# EAGLE design usb_switch (EAGLE 9.2.2)
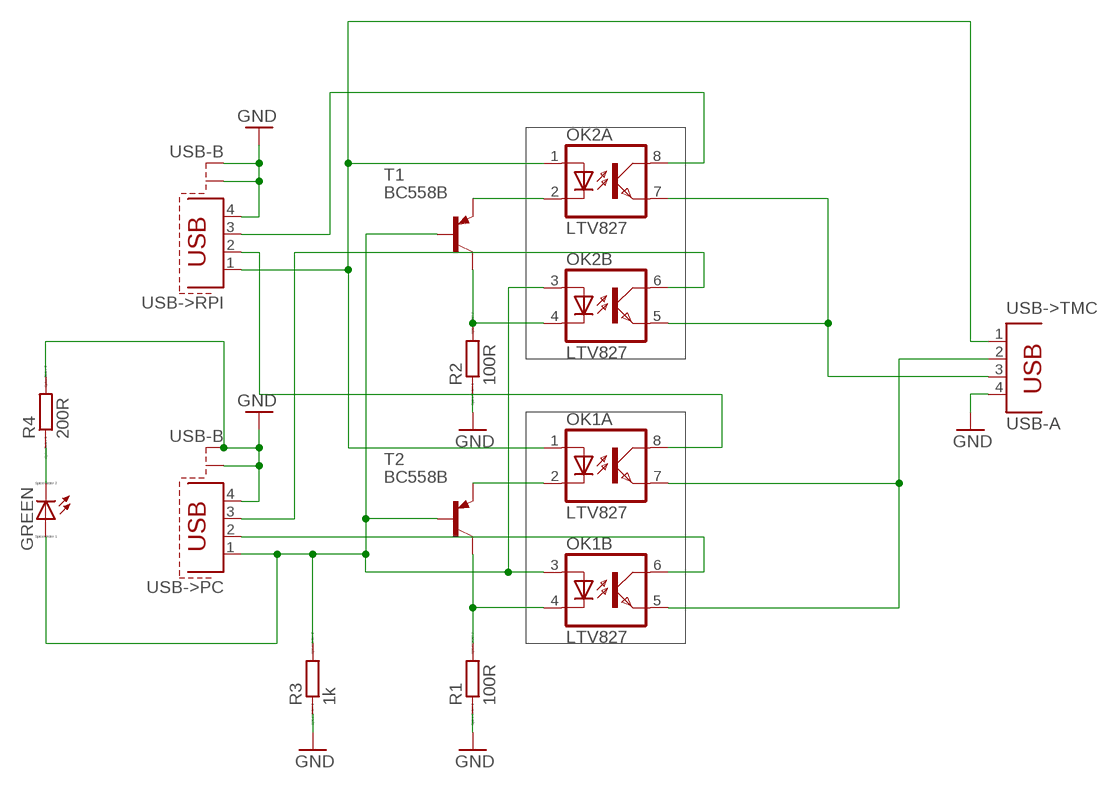
[diagram p0: schematic, sheet 1]

## Parts
GREEN  LED_ELD260  [LED_LD260]
OK1  LTV827  LTV826  [DIL08]
OK2  LTV827  LTV826  [DIL08]
R1  100R  R0204/7  [0204/7]
R2  100R  R0204/7  [0204/7]
R3  1k  R0204/7  [0204/7]
R4  200R  R0204/7  [0204/7]
T1  BC558B  -PNP-TO92-BEC  [TO92-BEC]
T2  BC558B  -PNP-TO92-BEC  [TO92-BEC]
USB->PC  USB-B  PN61729-S  [PN61729-S]
USB->RPI  USB-B  PN61729-S  [PN61729-S]
USB->TMC  USB-A  PN87520  [PN87520]

## Nets
GND: R1.1 R2.1 R3.1 R4.2 USB->PC.4 USB->PC.S1 USB->PC.S2 USB->RPI.4 USB->RPI.S1 USB->RPI.S2 USB->TMC.4
N$1: OK2.5(B:EMIT) OK2.7(A:EMIT) USB->TMC.3
N$2: OK1.5(B:EMIT) OK1.7(A:EMIT) USB->TMC.2
N$3: OK2.4(B:C) R2.2 T1.C
N$4: OK1.4(B:C) R1.2 T2.C
N$5: OK1.2(A:C) T2.E
N$6: OK2.2(A:C) T1.E
N$7: GREEN.A OK1.3(B:A) OK2.3(B:A) R3.2 T1.B T2.B USB->PC.1
N$8: OK1.1(A:A) OK2.1(A:A) USB->RPI.1 USB->TMC.1
N$9: OK2.8(A:COL) USB->RPI.3
N$10: OK2.6(B:COL) USB->PC.3
N$11: OK1.6(B:COL) USB->PC.2
N$12: OK1.8(A:COL) USB->RPI.2
N$15: GREEN.K(C) R4.1

## Library data of the parts
GREEN = eagle-ltspice:LED_E: LED Source: http://www.osram.convergy.de Source: www.luxeon.com Source: www.kingbright.com; SPICEMODEL: NONE; SPICEPREFIX: D; SPICETYPE: diode
OK1 OK2 = optocoupler:LTV826: OPTO COUPLER Source: LITEON, LTV816.pdf; OC_FARNELL: unknown; OC_NEWARK: unknown
R1-R4 = eagle-ltspice:R: RESISTOR, European symbol; SPICEMODEL: NONE; SPICEPREFIX: R
T1 T2 = transistor:*-PNP-: PNP Transistror
USB->PC USB->RPI = con-berg:PN61729-S: BERG USB connector; OC_FARNELL: unknown; OC_NEWARK: unknown
USB->TMC = con-berg:PN87520: BERG USB connector; OC_FARNELL: unknown; OC_NEWARK: unknown

## Board
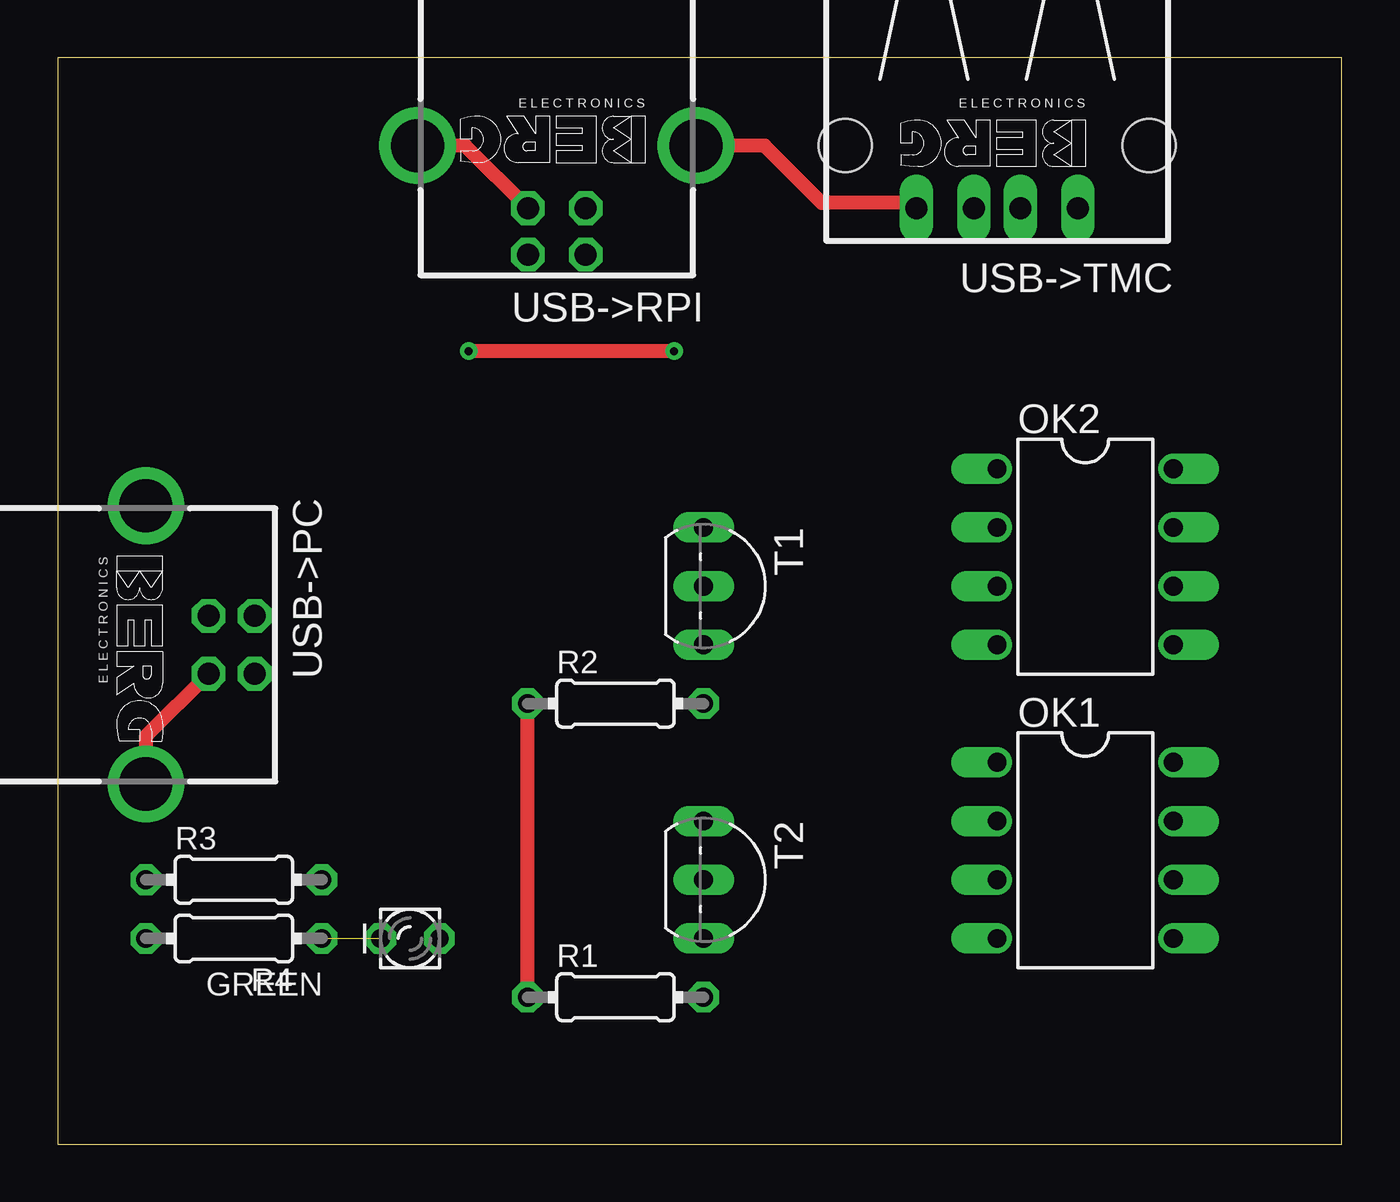
[diagram p1: board, top side]
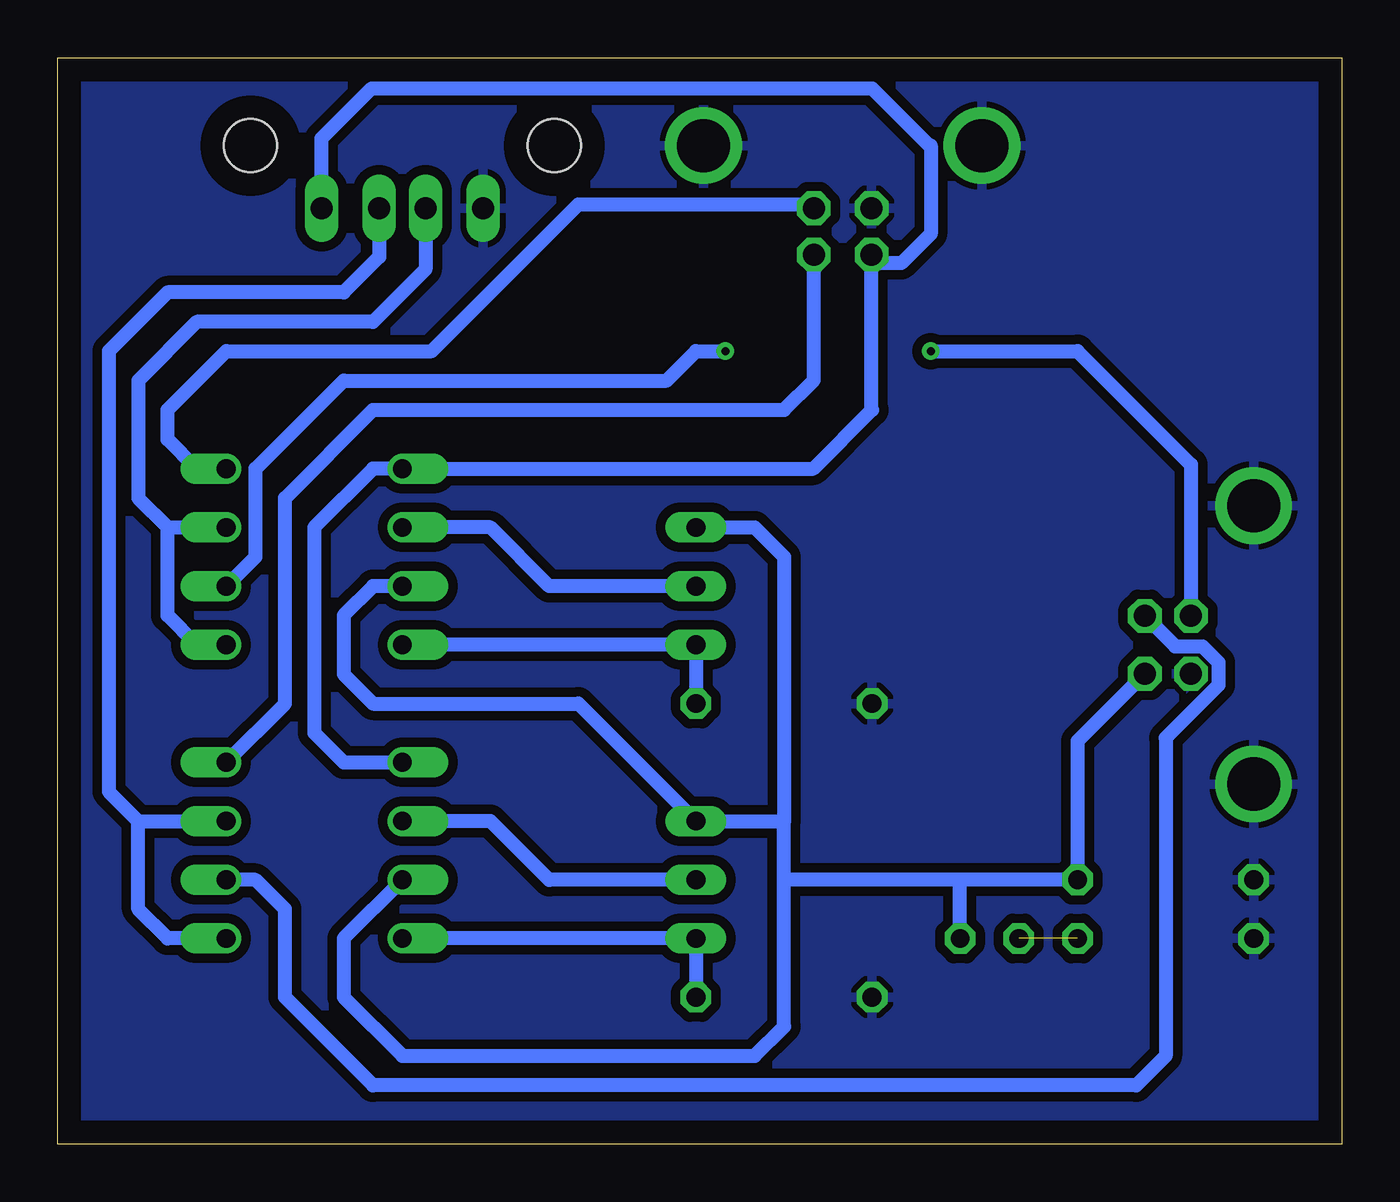
[diagram p2: board, bottom side, seen from below]

Size 55.55 x 46.98 mm. Coordinates in mm from the lower left corner, seen from the top.
Outline: 0,0 55.55,0 55.55,46.98 0,46.98 0,0
Copper layers (1*16): Top 0.035mm / dielectric 1.5mm / Bottom 0.035mm
Design rules "default": minimum track width 6mil, minimum drill 0.35mm, track to track 6mil, track to pad 6mil, pad to pad 6mil, via to via 6mil, smd to smd 6mil, copper to edge 40mil, drill to drill 6mil, minimum pad ring 10mil, minimum via ring 8mil, stop-mask expansion 4mil, vias tented up to drill 0mil, thermal gap 10mil

### Footprints (pad centres in the part's own frame; a part is rotated, then mirrored left to right if it is on the bottom)
LED_LD260 = drill 0.813 octagon: A -1.27,0; K 1.27,0
DIL08 = drill 0.813 offset: 1 -3.81,-3.81; 2 -1.27,-3.81; 3 1.27,-3.81; 4 3.81,-3.81; 5 3.81,3.81; 6 1.27,3.81; 7 -1.27,3.81; 8 -3.81,3.81
0204/7 = drill 0.813 octagon: 1 -3.81,0; 2 3.81,0
TO92-BEC = drill 0.813 long: B -2.54,0; C 2.54,0; E 0,0
PN61729-S = drill 0.95 octagon: 1 1.25,4.71; 2 -1.25,4.71; 3 -1.25,2.71; 4 1.25,2.71 | drill 2.3 pad 2.9: S1 -6.02,0; S2 6.02,0
PN87520 = drill 0.95 long: 1 -3.5,2.71; 2 -1,2.71; 3 1,2.71; 4 3.5,2.71 | hole 2.3: -6.57,0; 6.57,0

### Placement (x,y rotation side)
GREEN  15.24,8.89 180 top
OK1  44.45,12.7 270 top
OK2  44.45,25.4 270 top
R1  24.13,6.35 0 top
R2  24.13,19.05 0 top
R3  7.62,11.43 0 top
R4  7.62,8.89 180 top
T1  27.94,24.13 270 top
T2  27.94,11.43 270 top
USB->PC  3.81,21.59 270 top
USB->RPI  21.59,43.18 180 top
USB->TMC  40.64,43.18 180 top

### Tracks (layer width: path | path; a pad name or v marks a point on that pad's centre or on a via)
GND
  Top 0.61: USB->TMC.4 36.9,40.71 33.05,40.71 30.58,43.18 USB->RPI.S1 | USB->PC.4 3.81,17.63 USB->PC.S2 | R1.1 R2.1 | USB->RPI.4 17.63,43.18 USB->RPI.S2
  pour Bottom (isolate 0.406): 0,46.99 0,0 55.88,0 55.88,46.99
N$1
  Bottom 0.61: USB->TMC.3 39.64,37.83 41.91,35.56 49.53,35.56 52.07,33.02 52.07,27.94 50.8,26.67 | 50.8,26.67 OK2.7 | OK2.5 49.53,21.59 50.8,22.86 50.8,26.67
N$2
  Bottom 0.61: USB->TMC.2 41.64,38.37 43.18,36.83 50.8,36.83 53.34,34.29 53.34,15.24 52.07,13.97 | 52.07,13.97 OK1.7 | OK1.5 50.8,8.89 52.07,10.16 52.07,13.97
N$3
  Bottom 0.61: R2.2 T1.C OK2.4
N$4
  Bottom 0.61: R1.2 T2.C OK1.4
N$5
  Bottom 0.61: T2.E 34.29,11.43 36.83,13.97 OK1.2
N$6
  Bottom 0.61: T1.E 34.29,24.13 36.83,26.67 OK2.2
N$7
  Bottom 0.61: 24.13,13.97 T2.B 33.02,19.05 41.91,19.05 43.18,20.32 43.18,22.86 41.91,24.13 OK2.3 | T1.B 25.4,26.67 24.13,25.4 24.13,13.97 | OK1.3 43.18,8.89 43.18,6.35 40.64,3.81 25.4,3.81 24.13,5.08 24.13,11.43 | 24.13,11.43 24.13,13.97 | USB->PC.1 11.43,17.43 R3.2 16.51,11.43 | 16.51,11.43 24.13,11.43 | GREEN.A 16.51,11.43
N$8
  Bottom 0.61: 20.34,38.1 20.34,31.77 20.32,31.75 22.86,29.21 OK2.1 41.91,29.21 44.45,26.67 44.45,17.78 43.18,16.51 OK1.1 | 20.34,38.1 USB->RPI.1 | USB->TMC.1 44.14,43.49 41.97,45.66 20.32,45.66 17.84,43.18 17.78,43.18 17.78,39.37 19.05,38.1 20.34,38.1
N$9
  Bottom 0.61: OK2.8 49.53,29.21 50.8,30.48 50.8,31.75 48.26,34.29 39.37,34.29 33.02,40.64 23.01,40.64 USB->RPI.3
N$10  (via drill 0.35)
  Top 0.61: v26.67,34.29 v17.78,34.29
  Bottom 0.61: OK2.6 46.99,25.4 46.99,29.21 43.18,33.02 29.21,33.02 27.94,34.29 v26.67,34.29 | v17.78,34.29 11.43,34.29 6.52,29.38 USB->PC.3
N$11
  Bottom 0.61: OK1.6 46.99,11.43 45.72,10.16 45.72,6.35 41.91,2.54 8.89,2.54 7.62,3.81 7.62,17.56 5.33,19.85 5.33,20.83 6.03,21.53 7.21,21.53 USB->PC.2
N$12
  Bottom 0.61: USB->RPI.2 22.84,33.04 24.13,31.75 41.91,31.75 45.72,27.94 45.72,19.05 OK1.8
N$15  (1 unrouted)